# EAGLE design Equilizer_Protoboard (EAGLE 6.3)
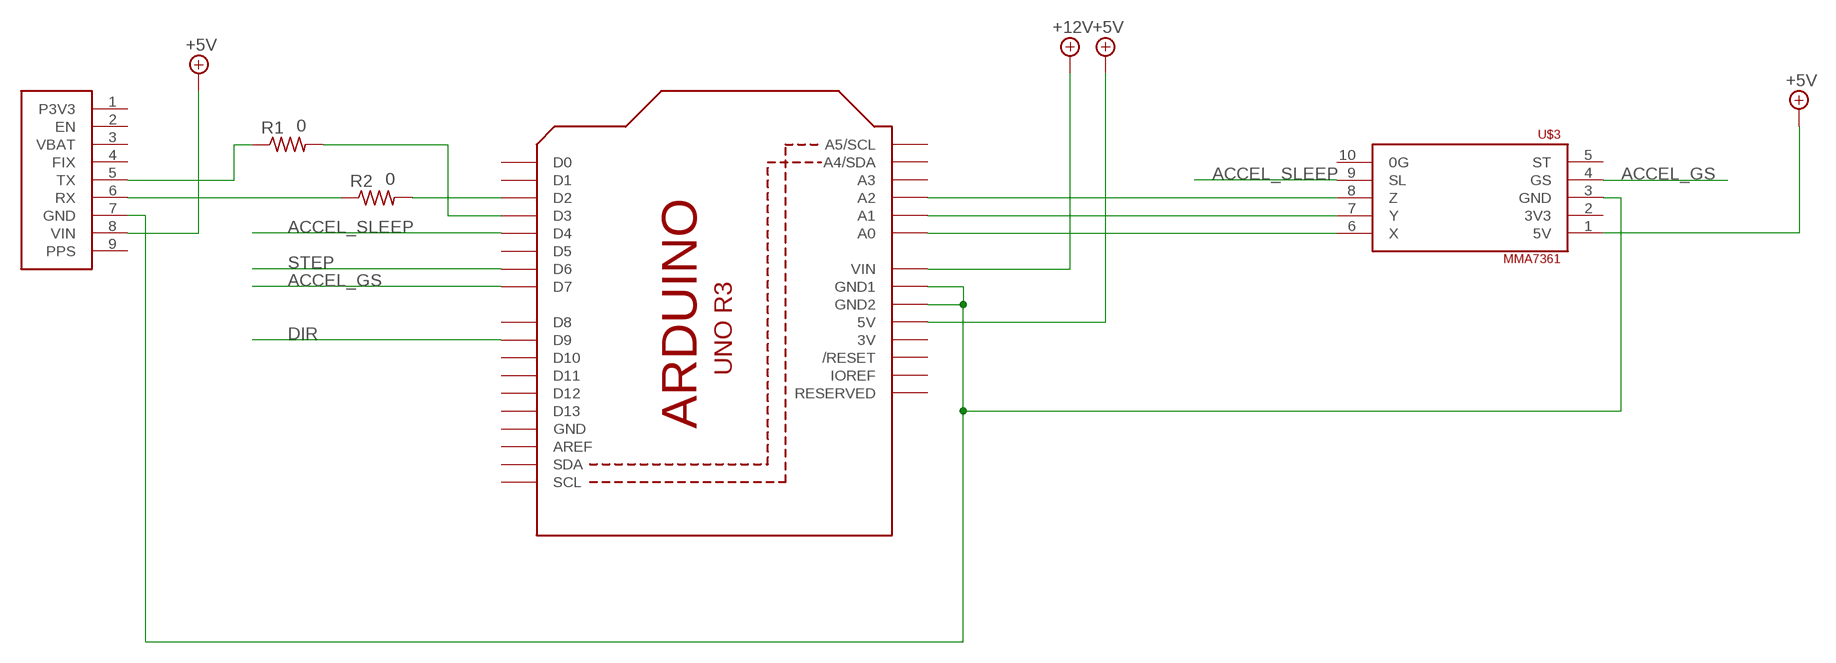
[diagram p0: schematic, sheet 1]

## Parts
R1  0  R-US_0204/7  [0204/7]
R2  0  R-US_0204/7  [0204/7]
U1  ARDUINOR3-BPLACE  [ARDUINOR3-BPLACE]
U$3  MMA7361  [MMA7361]
U$4  ADAFRUIT_GPS_MODULE  [ADAFRUIT_GPS_BREAKOUT]

## Nets
+5V [power]: U1.5V U$3.1(5V) U$4.8(VIN)
+12V [power]: U1.VIN
ACCEL_GS: U1.D7 U$3.4(GS)
ACCEL_SLEEP: U1.D4 U$3.9(SL)
DIR: U1.D9
N$1 [power]: U1.GND1 U1.GND2 U$3.3(GND) U$4.7(GND)
N$2: R2.1 U$4.6(RX)
N$3: R1.1 U$4.5(TX)
N$4: R1.2 U1.D3
N$5: R2.2 U1.D2
N$10: U1.A2 U$3.8(Z)
N$11: U1.A1 U$3.7(Y)
N$12: U1.A0 U$3.6(X)
STEP: U1.D6
Unconnected: U1.A3 U1.A4(A4/SDA) U1.A5(A5/SCL) U1.AREF U1.D0 U1.D1 U1.D5 U1.D8 U1.D10 U1.D11 U1.D12 U1.D13 U1.IOREF U1.RESERVED U1.RESET(/RESET) U1.SCL U1.SDA U$3.2(3V3) U$3.5(ST) U$3.10(0G) U$4.1(P3V3) U$4.2(EN) U$4.3(VBAT) U$4.4(FIX) U$4.9(PPS)

## Power pins joined to a net without a drawn wire
3V: U1.3V
GND: U1.GND

## Library data of the parts
R1 R2 = adafruit:R-US_: RESISTOR, American symbol
U1 = adafruit:ARDUINOR3: This is a new object for the new Arduino R3 - with extra pins that you may want to use (such as IOref, and duplicated A4/A5
U$3 = custom:MMA7361
U$4 = custom:ADAFRUIT_GPS_MODULE

## Net classes
0 default: width 0.508 mm, drill 0.889 mm, clearance 0.508 mm
1 power: width 1.27 mm, drill 0.889 mm, clearance 0.508 mm to class 0, clearance 0.508 mm

## Board
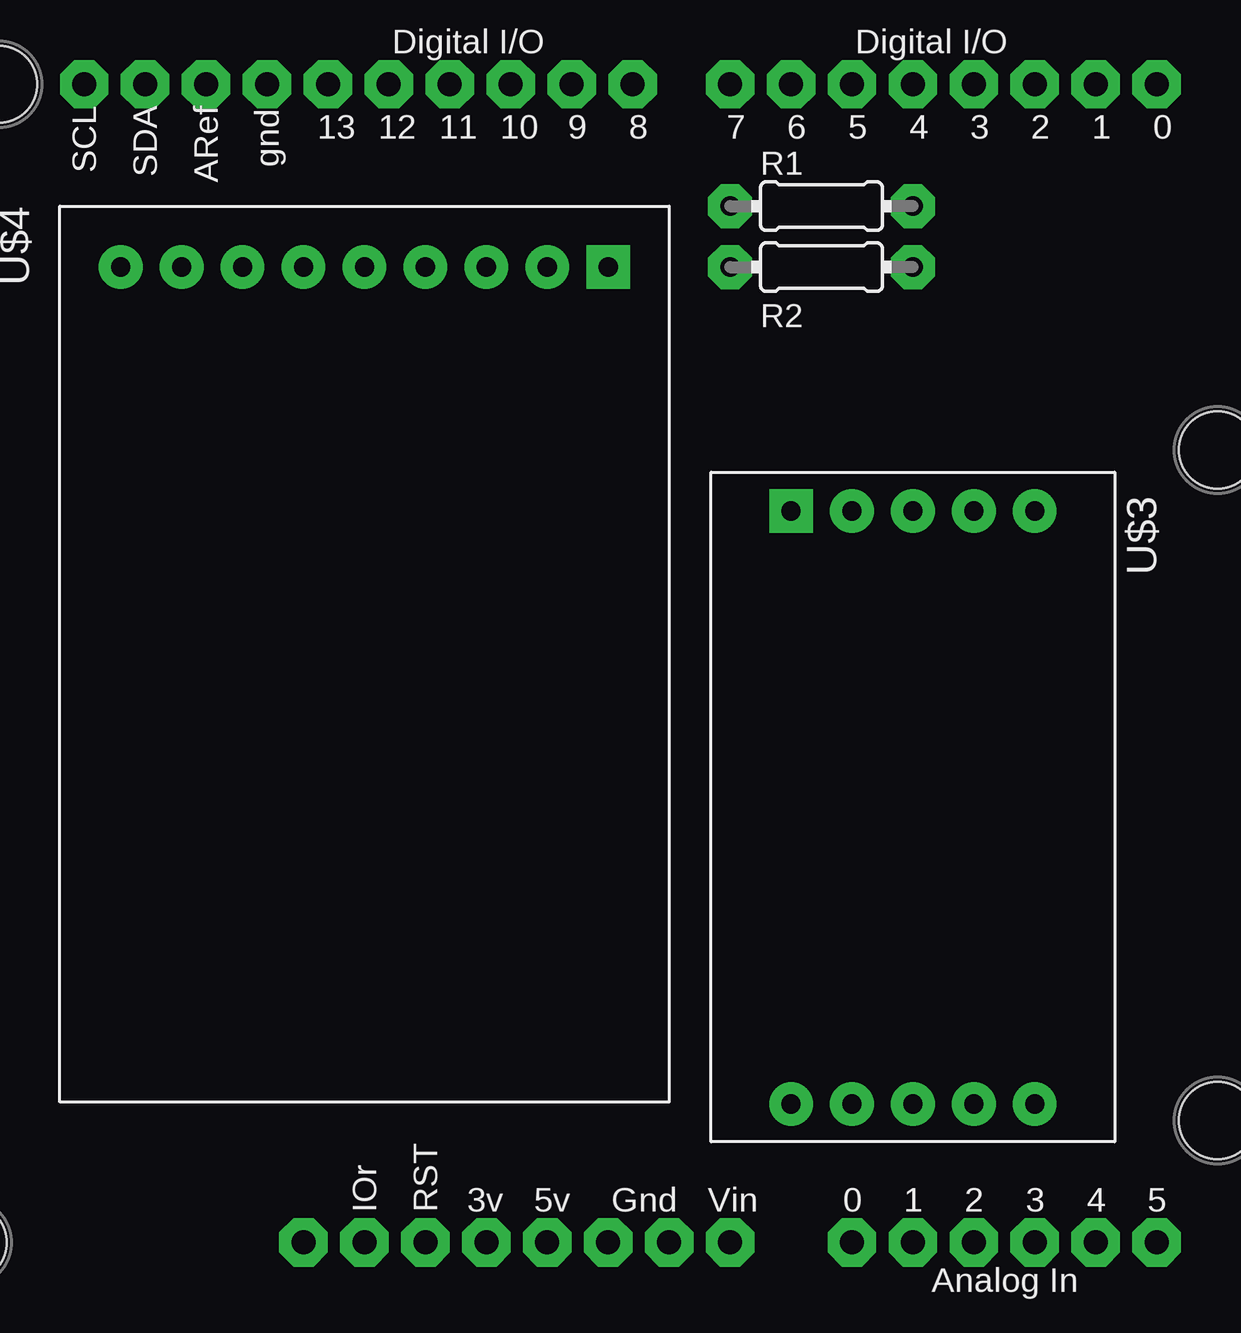
[diagram p1: board, top side]
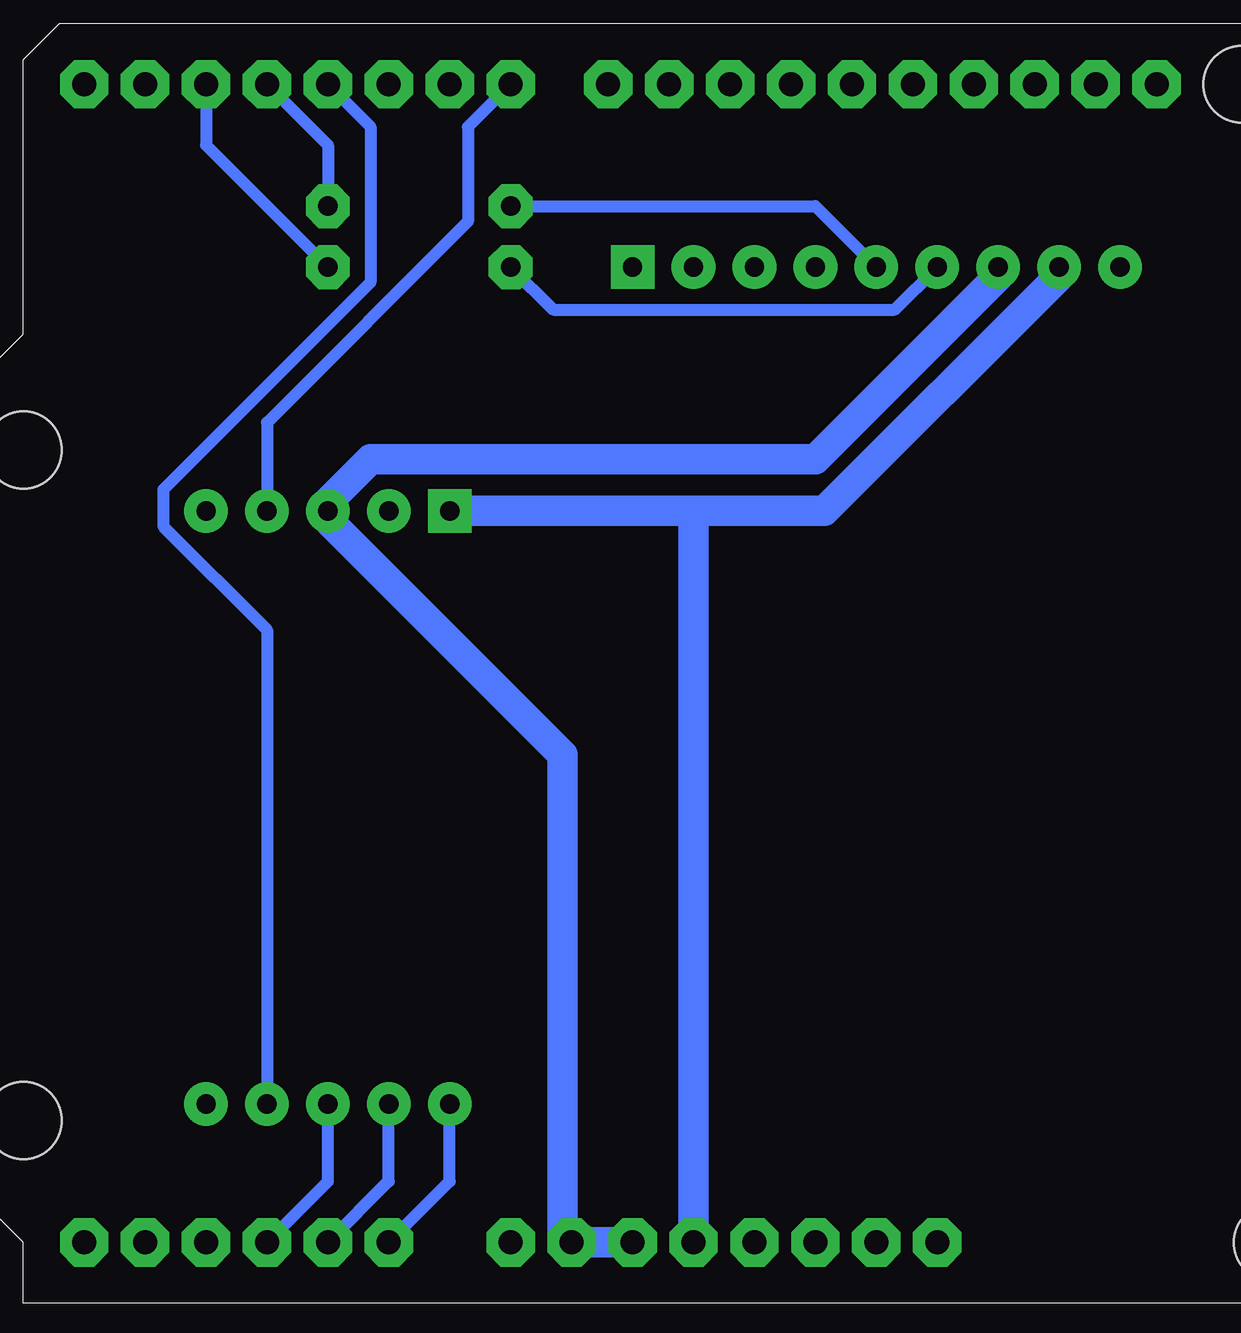
[diagram p2: board, bottom side, seen from below]

No outline drawn. Coordinates in mm, seen from the top.
Copper layers (1*16): Top 0.035mm / dielectric 1.5mm / Bottom 0.035mm
Design rules "default *": minimum track width 10mil, minimum drill 24mil, track to track 8mil, track to pad 8mil, pad to pad 8mil, via to via 8mil, smd to smd 8mil, copper to edge 40mil, drill to drill 8mil, minimum pad ring 20mil, minimum via ring 20mil, stop-mask expansion 4mil, vias tented up to drill 0mil, thermal gap 10mil
Holes 3.2 mm at 15.24,50.8 66.04,35.56 66.04,7.62 13.97,2.54

### Footprints (pad centres in the part's own frame; a part is rotated, then mirrored left to right if it is on the bottom)
0204/7 = drill 0.813 pad 1.676 octagon: 1 -3.81,0; 2 3.81,0
ARDUINOR3-BPLACE = drill 1 pad 1.676 octagon: 3V 35.56,2.54; 5V 38.1,2.54; A0 50.8,2.54; A1 53.34,2.54; A2 55.88,2.54; A3 58.42,2.54; A4 60.96,2.54; A5 63.5,2.54; AREF 23.876,50.8; D0 63.5,50.8; D1 60.96,50.8; D2 58.42,50.8; D3 55.88,50.8; D4 53.34,50.8; D5 50.8,50.8; D6 48.26,50.8; D7 45.72,50.8; D8 41.656,50.8; D9 39.116,50.8; D10 36.576,50.8; D11 34.036,50.8; D12 31.496,50.8; D13 28.956,50.8; GND 26.416,50.8; GND1 43.18,2.54; GND2 40.64,2.54; IOREF 30.48,2.54; RESERVED 27.94,2.54; RESET 33.02,2.54; SCL 18.796,50.8; SDA 21.336,50.8; VIN 45.72,2.54
MMA7361 = drill 0.8 square: 1 0,0 | drill 0.8: 2 0,2.54; 3 0,5.08; 4 0,7.62; 5 0,10.16; 6 24.714,0; 7 24.714,2.54; 8 24.714,5.08; 9 24.714,7.62; 10 24.714,10.16
ADAFRUIT_GPS_BREAKOUT = drill 0.8 pad 1.778 square: 1 0,0 | drill 0.8 pad 1.778: 2 0,-2.54; 3 0,-5.08; 4 0,-7.62; 5 0,-10.16; 6 0,-12.7; 7 0,-15.24; 8 0,-17.78; 9 0,-20.32

### Placement (x,y rotation side)
R1  49.53,45.72 0 top
R2  49.53,43.18 0 top
U1  0,0 0 top
U$3  48.26,33.02 270 top
U$4  40.64,43.18 270 top

### Tracks (layer width: path | path; a pad name or v marks a point on that pad's centre or on a via)
+5V
  Bottom 1.27: U$4.8 22.86,42.8 32.64,33.02 38.1,33.02 | U$3.1 38.1,33.02 | 38.1,33.02 U1.5V
ACCEL_GS
  Bottom 0.508: U$3.4 55.88,36.7 47.5,45.09 47.5,49.02 U1.D7
ACCEL_SLEEP
  Bottom 0.508: U$3.9 55.88,28.07 60.2,32.38 60.2,33.91 51.56,42.55 51.56,49.02 U1.D4
N$1
  Bottom 1.27: U1.GND2 U1.GND1 43.56,3.05 43.56,22.86 53.21,32.51 U$3.3 53.34,33.4 51.56,35.18 33.02,35.18 25.4,42.8 U$4.7
N$2
  Bottom 0.508: U$4.6 29.72,41.4 43.94,41.4 R2.1
N$3
  Bottom 0.508: U$4.5 33.02,45.72 R1.1
N$4
  Bottom 0.508: R1.2 53.34,48.26 U1.D3
N$5
  Bottom 0.508: R2.2 58.42,48.26 U1.D2
N$10
  Bottom 0.508: U$3.8 53.34,5.08 U1.A2
N$11
  Bottom 0.508: U$3.7 50.8,5.08 U1.A1
N$12
  Bottom 0.508: U$3.6 48.26,5.08 U1.A0